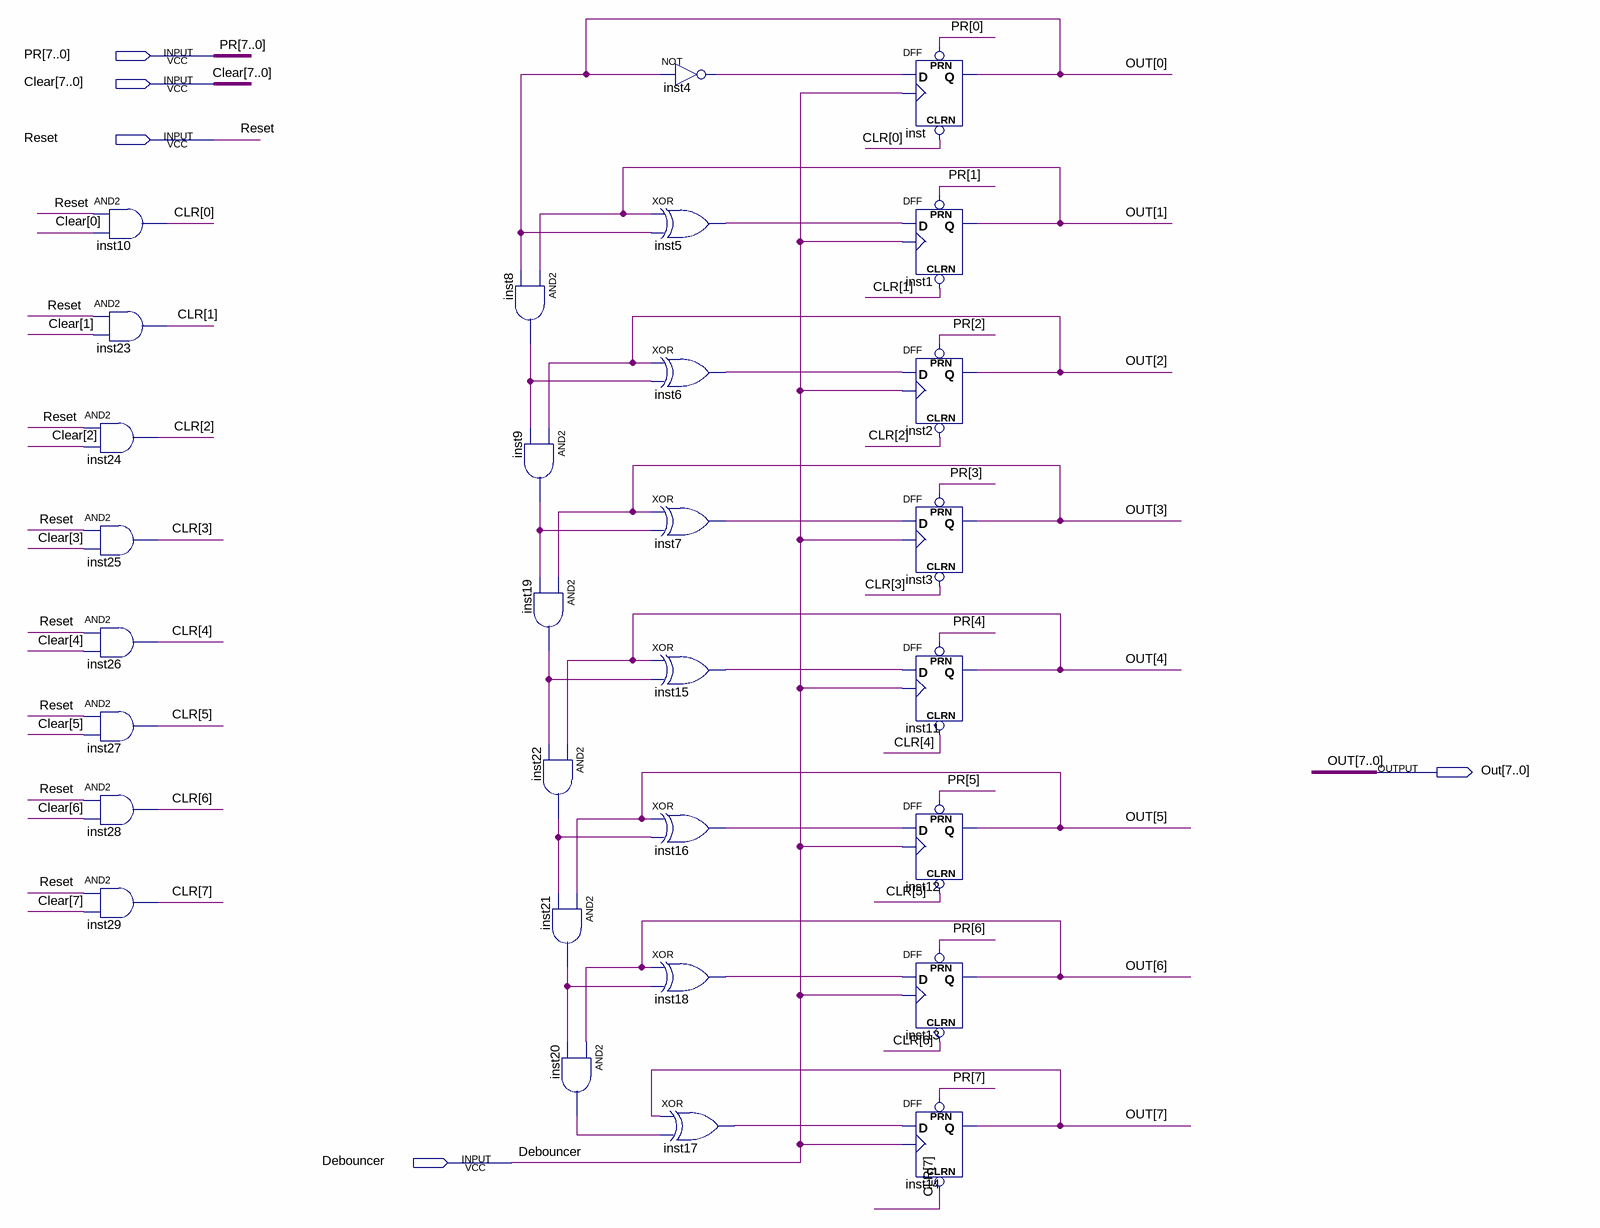
[diagram p0: schematic sheet]
// Quartus schematic Contador.bdf as structural Verilog: 30 symbols, 5 pins
module Contador (
  input  [7:0] PR,
  input  [7:0] Clear,
  input  Reset,
  input  Debouncer,
  output [7:0] Out
);

  wire inst4_out, inst5_out, inst6_out, inst7_out, inst8_out, inst9_out, inst15_out, inst16_out, inst17_out,
       inst18_out, inst19_out, inst20_out, inst21_out, inst22_out;
  wire [7:0] CLR;

  and inst10 (CLR[0], Reset, Clear[0]);
  and inst23 (CLR[1], Reset, Clear[1]);
  and inst24 (CLR[2], Reset, Clear[2]);
  and inst25 (CLR[3], Reset, Clear[3]);
  and inst26 (CLR[4], Reset, Clear[4]);
  and inst27 (CLR[5], Reset, Clear[5]);
  and inst28 (CLR[6], Reset, Clear[6]);
  and inst29 (CLR[7], Reset, Clear[7]);
  and inst8 (inst8_out, Out[1], Out[0]);
  and inst9 (inst9_out, Out[2], inst8_out);
  and inst19 (inst19_out, Out[3], inst9_out);
  and inst22 (inst22_out, Out[4], inst19_out);
  and inst21 (inst21_out, Out[5], inst22_out);
  and inst20 (inst20_out, Out[6], inst21_out);
  xor inst5 (inst5_out, Out[1], Out[0]);
  xor inst6 (inst6_out, Out[2], inst8_out);
  xor inst7 (inst7_out, Out[3], inst9_out);
  xor inst15 (inst15_out, Out[4], inst19_out);
  xor inst16 (inst16_out, Out[5], inst22_out);
  xor inst18 (inst18_out, Out[6], inst21_out);
  not inst4 (inst4_out, Out[0]);
  xor inst17 (inst17_out, Out[7], inst20_out);
  DFF inst (.CLRN(CLR[0]), .CLK(Debouncer), .D(inst4_out), .PRN(PR[0]), .Q(Out[0]));
  DFF inst1 (.CLRN(CLR[1]), .CLK(Debouncer), .D(inst5_out), .PRN(PR[1]), .Q(Out[1]));
  DFF inst2 (.CLRN(CLR[2]), .CLK(Debouncer), .D(inst6_out), .PRN(PR[2]), .Q(Out[2]));
  DFF inst3 (.CLRN(CLR[3]), .CLK(Debouncer), .D(inst7_out), .PRN(PR[3]), .Q(Out[3]));
  DFF inst11 (.CLRN(CLR[4]), .CLK(Debouncer), .D(inst15_out), .PRN(PR[4]), .Q(Out[4]));
  DFF inst12 (.CLRN(CLR[5]), .CLK(Debouncer), .D(inst16_out), .PRN(PR[5]), .Q(Out[5]));
  DFF inst13 (.CLRN(CLR[6]), .CLK(Debouncer), .D(inst18_out), .PRN(PR[6]), .Q(Out[6]));
  DFF inst14 (.CLRN(CLR[7]), .CLK(Debouncer), .D(inst17_out), .PRN(PR[7]), .Q(Out[7]));
endmodule
